# Altium schematic sheet SCH_A2_TempClassic.SchDoc
size A2
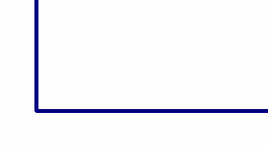
[diagram p0: SCH_A2_TempClassic.SchDoc, bottom left]